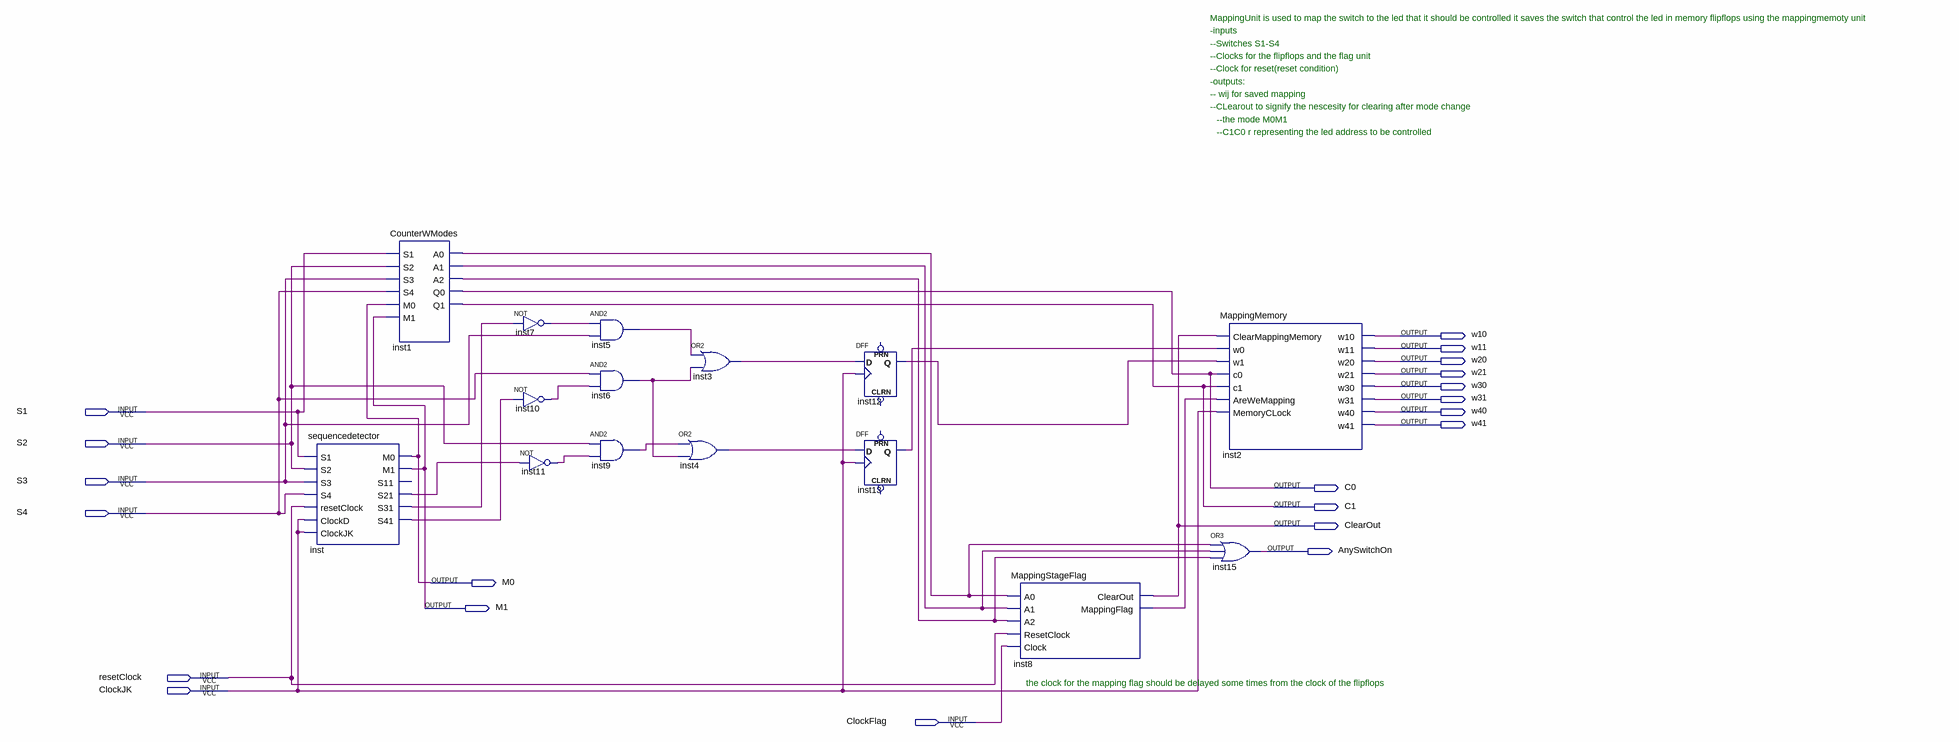
[diagram p0: schematic sheet]
// Quartus schematic MappingUnit.bdf as structural Verilog: 15 symbols, 21 pins
module MappingUnit (
  input  S1,
  input  S2,
  input  S3,
  input  S4,
  input  resetClock,
  input  ClockJK,
  input  ClockFlag,
  output w10,
  output w11,
  output w20,
  output w21,
  output w30,
  output w31,
  output w40,
  output w41,
  output C0,
  output C1,
  output ClearOut,
  output AnySwitchOn,
  output M0,
  output M1
);

  wire inst1_a0, inst1_a1, inst1_a2, inst3_out, inst4_out, inst5_out, inst6_out, inst7_out,
       inst8_mappingflag, inst9_out, inst10_out, inst11_out, inst12_q, inst13_q, inst_s21, inst_s31, inst_s41;

  sequencedetector inst (
    .S1(S1), .S2(S2), .S3(S3), .S4(S4), .resetClock(resetClock), .ClockD(ClockJK), .ClockJK(ClockJK),
    .M0(M0), .M1(M1), .S21(inst_s21), .S31(inst_s31), .S41(inst_s41));  // open: S11
  CounterWModes inst1 (
    .S1(S1), .S2(S2), .S3(S3), .S4(S4), .M0(M0), .M1(M1), .A0(inst1_a0), .A1(inst1_a1), .A2(inst1_a2),
    .Q0(C0), .Q1(C1));
  not inst7 (inst7_out, inst_s31);
  not inst10 (inst10_out, inst_s41);
  not inst11 (inst11_out, inst_s21);
  and inst5 (inst5_out, inst7_out, S3);
  and inst6 (inst6_out, S4, inst10_out);
  and inst9 (inst9_out, S2, inst11_out);
  or inst3 (inst3_out, inst5_out, inst6_out);
  or inst4 (inst4_out, inst9_out, inst6_out);
  DFF inst12 (.CLK(ClockJK), .D(inst3_out), .Q(inst12_q));  // open: CLRN, PRN
  DFF inst13 (.CLK(ClockJK), .D(inst4_out), .Q(inst13_q));  // open: CLRN, PRN
  MappingStageFlag inst8 (
    .A0(inst1_a0), .A1(inst1_a1), .A2(inst1_a2), .ResetClock(resetClock), .Clock(ClockFlag),
    .ClearOut(ClearOut), .MappingFlag(inst8_mappingflag));
  or inst15 (AnySwitchOn, inst1_a0, inst1_a1, inst1_a2);
  MappingMemory inst2 (
    .ClearMappingMemory(ClearOut), .w0(inst13_q), .w1(inst12_q), .c0(C0), .c1(C1),
    .AreWeMapping(inst8_mappingflag), .MemoryCLock(ClockJK), .w10(w10), .w11(w11), .w20(w20), .w21(w21),
    .w30(w30), .w31(w31), .w40(w40), .w41(w41));

  // Notes on the sheet:
  //   MappingUnit is used to map the switch to the led that it should be controlled it saves the switch that control the led in memory flipflops using the mappingmemoty unit
  //   -inputs
  //   --Switches S1-S4
  //   --Clocks for the flipflops and the flag unit
  //   --Clock for reset(reset condition)
  //   -outputs:
  //   -- wij for saved mapping
  //   --CLearout to signify the nescesity for clearing after mode change
  //   --the mode M0M1
  //   --C1C0 r representing the led address to be controlled
  //   the clock for the mapping flag should be delayed some times from the clock of the flipflops
endmodule
